# EAGLE design PCB-TOP_FINAL (EAGLE 7.6.0)
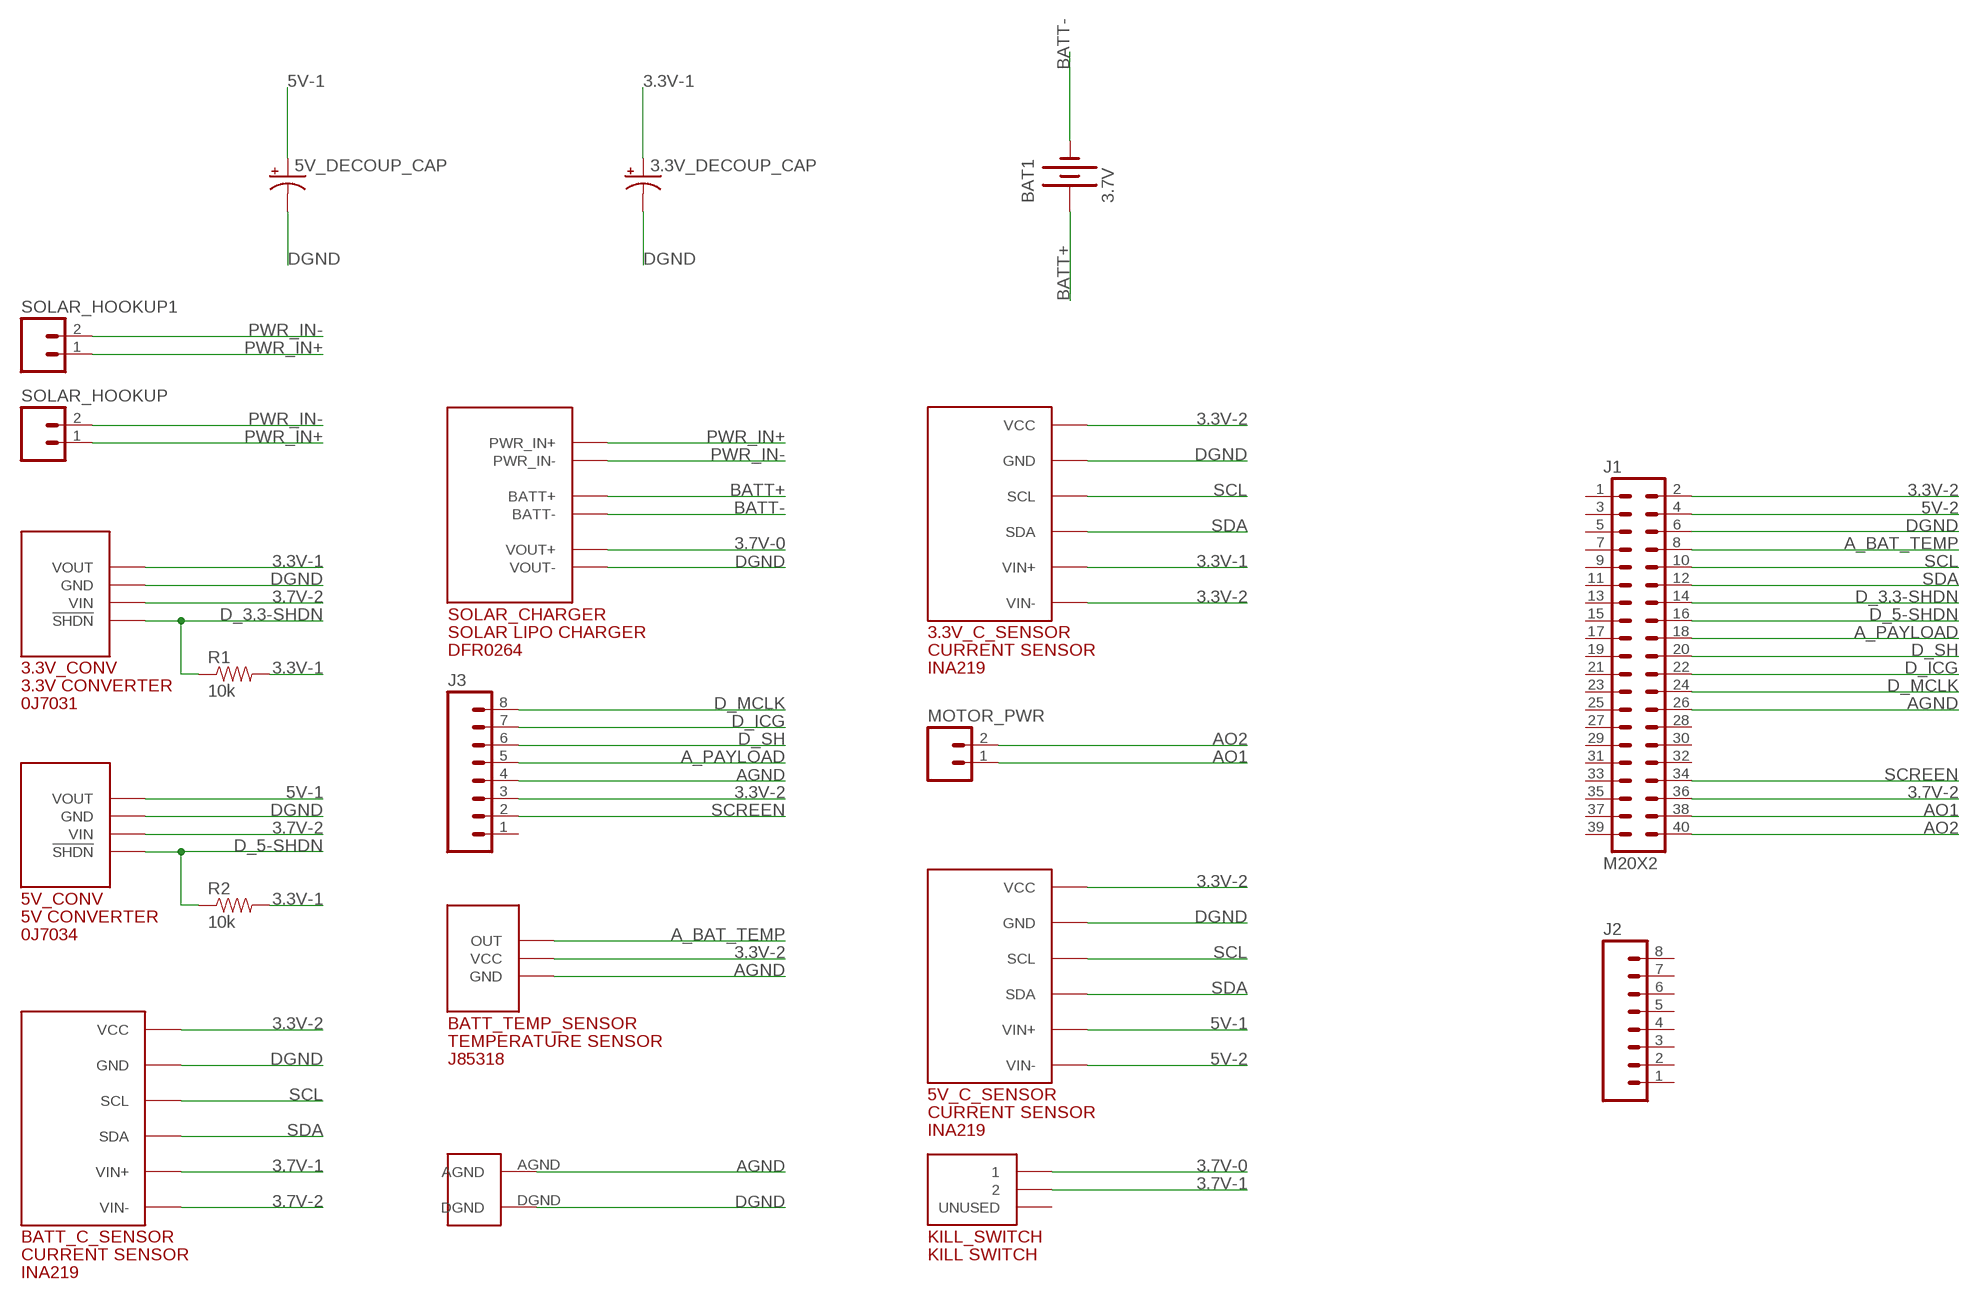
[diagram p0: schematic, sheet 1]

## Parts
3.3V_C_SENSOR  ADAFRUIT_INA219_DEVICE  [C1_ADAFRUIT_INA219_CURPOWERMONITOR]
3.3V_CONV  3V3CONVERTERDIP4  [DIP4]
3.3V_DECOUP_CAP  CAP_POLPTH1  [CPOL-RADIAL-100UF-25V]
5V_C_SENSOR  ADAFRUIT_INA219_DEVICE  [C1_ADAFRUIT_INA219_CURPOWERMONITOR]
5V_CONV  DIP14DIP4  [DIP4]
5V_DECOUP_CAP  CAP_POLPTH1  [CPOL-RADIAL-100UF-25V]
BAT1  3.7V  BATTERY18650  [BATTERY_18650-HOLDER]
BATT_C_SENSOR  ADAFRUIT_INA219_DEVICE  [C1_ADAFRUIT_INA219_CURPOWERMONITOR]
BATT_TEMP_SENSOR  TEMP_SENSORDIP3  [DIP3]
J1  M20X2  [2X20]
J2  M08  [1X08_ROUND]
J3  M08  [1X08_ROUND]
KILL_SWITCH  KILLSWITCH_V2_DEVICE  [KILLSWITCH_V2_PACKAGE]
MOTOR_PWR  M02PTH  [1X02]
R1  10k  10KOHM-1/4W-1%(PTH)HORIZ  [AXIAL-0.3]
R2  10k  10KOHM-1/4W-1%(PTH)HORIZ  [AXIAL-0.3]
SOLAR_CHARGER  SOLAR_CHARGER_DEVICE  [SOLAR_CHARGER_PACKAGE]
SOLAR_HOOKUP  M02PTH  [1X02]
SOLAR_HOOKUP1  M02PTH  [1X02]
U$1  GROUNDPLANECONNECTION_BOTTOM  [GROUNDPLANECONNECTION_BOTTOM]

## Nets
3.3V-1: 3.3V_C_SENSOR.VIN+ 3.3V_CONV.VOUT 3.3V_DECOUP_CAP.1(+) R1.P$2 R2.P$2
3.3V-2: 3.3V_C_SENSOR.VCC 3.3V_C_SENSOR.VIN- 5V_C_SENSOR.VCC BATT_C_SENSOR.VCC BATT_TEMP_SENSOR.VCC J1.2 J3.3
3.7V-0: KILL_SWITCH.1 SOLAR_CHARGER.VOUT+
3.7V-1: BATT_C_SENSOR.VIN+ KILL_SWITCH.2
3.7V-2: 3.3V_CONV.VIN 5V_CONV.VIN BATT_C_SENSOR.VIN- J1.36
5V-1: 5V_C_SENSOR.VIN+ 5V_CONV.VOUT 5V_DECOUP_CAP.1(+)
5V-2: 5V_C_SENSOR.VIN- J1.4
A_BAT_TEMP: BATT_TEMP_SENSOR.OUT J1.8
A_PAYLOAD: J1.18 J3.5
AGND: BATT_TEMP_SENSOR.GND J1.26 J3.4 U$1.AGND
AO1: J1.38 MOTOR_PWR.1
AO2: J1.40 MOTOR_PWR.2
BATT+: BAT1.PWR@1(+) SOLAR_CHARGER.BATT+
BATT-: BAT1.GND@1(-) SOLAR_CHARGER.BATT-
D_3.3-SHDN: 3.3V_CONV.SHDN(!SHDN!) J1.14 R1.P$1
D_5-SHDN: 5V_CONV.SHDN(!SHDN!) J1.16 R2.P$1
D_ICG: J1.22 J3.7
D_MCLK: J1.24 J3.8
D_SH: J1.20 J3.6
DGND: 3.3V_C_SENSOR.GND 3.3V_CONV.GND 3.3V_DECOUP_CAP.2(-) 5V_C_SENSOR.GND 5V_CONV.GND 5V_DECOUP_CAP.2(-) BATT_C_SENSOR.GND J1.6 SOLAR_CHARGER.VOUT- U$1.DGND
PWR_IN+: SOLAR_CHARGER.PWR_IN+ SOLAR_HOOKUP1.1 SOLAR_HOOKUP.1
PWR_IN-: SOLAR_CHARGER.PWR_IN- SOLAR_HOOKUP1.2 SOLAR_HOOKUP.2
SCL: 3.3V_C_SENSOR.SCL 5V_C_SENSOR.SCL BATT_C_SENSOR.SCL J1.10
SCREEN: J1.34 J3.2
SDA: 3.3V_C_SENSOR.SDA 5V_C_SENSOR.SDA BATT_C_SENSOR.SDA J1.12
Unconnected: J1.1 J1.3 J1.5 J1.7 J1.9 J1.11 J1.13 J1.15 J1.17 J1.19 J1.21 J1.23 J1.25 J1.27 J1.28 J1.29 J1.30 J1.31 J1.32 J1.33 J1.35 J1.37 J1.39 J2.1 J2.2 J2.3 J2.4 J2.5 J2.6 J2.7 J2.8 J3.1 KILL_SWITCH.UNUSED

## Library data of the parts
3.3V_C_SENSOR 5V_C_SENSOR BATT_C_SENSOR = Adafruit_INA219:ADAFRUIT_INA219_DEVICE
3.3V_CONV = 3v3Converter-0J7031:3V3CONVERTER
3.3V_DECOUP_CAP 5V_DECOUP_CAP = SparkFun-Passives:CAP_POL: Capacitor Polarized These are standard SMD and PTH capacitors. Normally 10uF, 47uF, and 100uF in electrolytic and tantalum varieties. Always verify the external diameter of the through hole cap, it varies with capacity, voltage, and manufacturer. The EIA devices should be standard.
5V_CONV = 5VConverter_0J7034:DIP14
BAT1 = SparkFun-Electromechanical:BATTERY: Battery Holders Various common sizes : AA, AAA, 18650 (PRT-12895), 20mm coin cell and 12mm coin cell. 20MM_4LEGS, BATT-10373
BATT_TEMP_SENSOR = Temp_Sensor_K853518:TEMP_SENSOR
J1 = SparkFun-Connectors:M20X2: 0.1" spaced headers
J2 J3 = SparkFun-Connectors:M08: Header 8 Standard 8-pin 0.1" header. Use with straight break away headers (SKU : PRT-00116), right angle break away headers (PRT-00553), swiss pins (PRT-00743), machine pins (PRT-00117), and female headers (PRT-00115).; PROD_ID: CONN-08437
KILL_SWITCH = Kill Switch_v2:KILLSWITCH_V2_DEVICE
MOTOR_PWR SOLAR_HOOKUP SOLAR_HOOKUP1 = SparkFun-Connectors:M02: Standard 2-pin 0.1" header. Use with - straight break away headers ( PRT-00116) - right angle break away headers (PRT-00553) - swiss pins (PRT-00743) - machine pins (PRT-00117) - female headers (PRT-00115) Molex polarized connector foot print use with: PRT-08233 with associated crimp pins and housings. 2.54_SCREWTERM for use with PRT-10571. 3.5mm Screw Terminal footprints for PRT-08084 5mm Screw Terminal footprints for use with PRT-08432
R1 R2 = SparkFun-Resistors:10KOHM-1/4W-1%(PTH): RES-12183; PROD_ID: RES-12183
SOLAR_CHARGER = Solar Charger:SOLAR_CHARGER_DEVICE
U$1 = BOTTOM_Groundplaneconnection:GROUNDPLANECONNECTION_BOTTOM

## Board
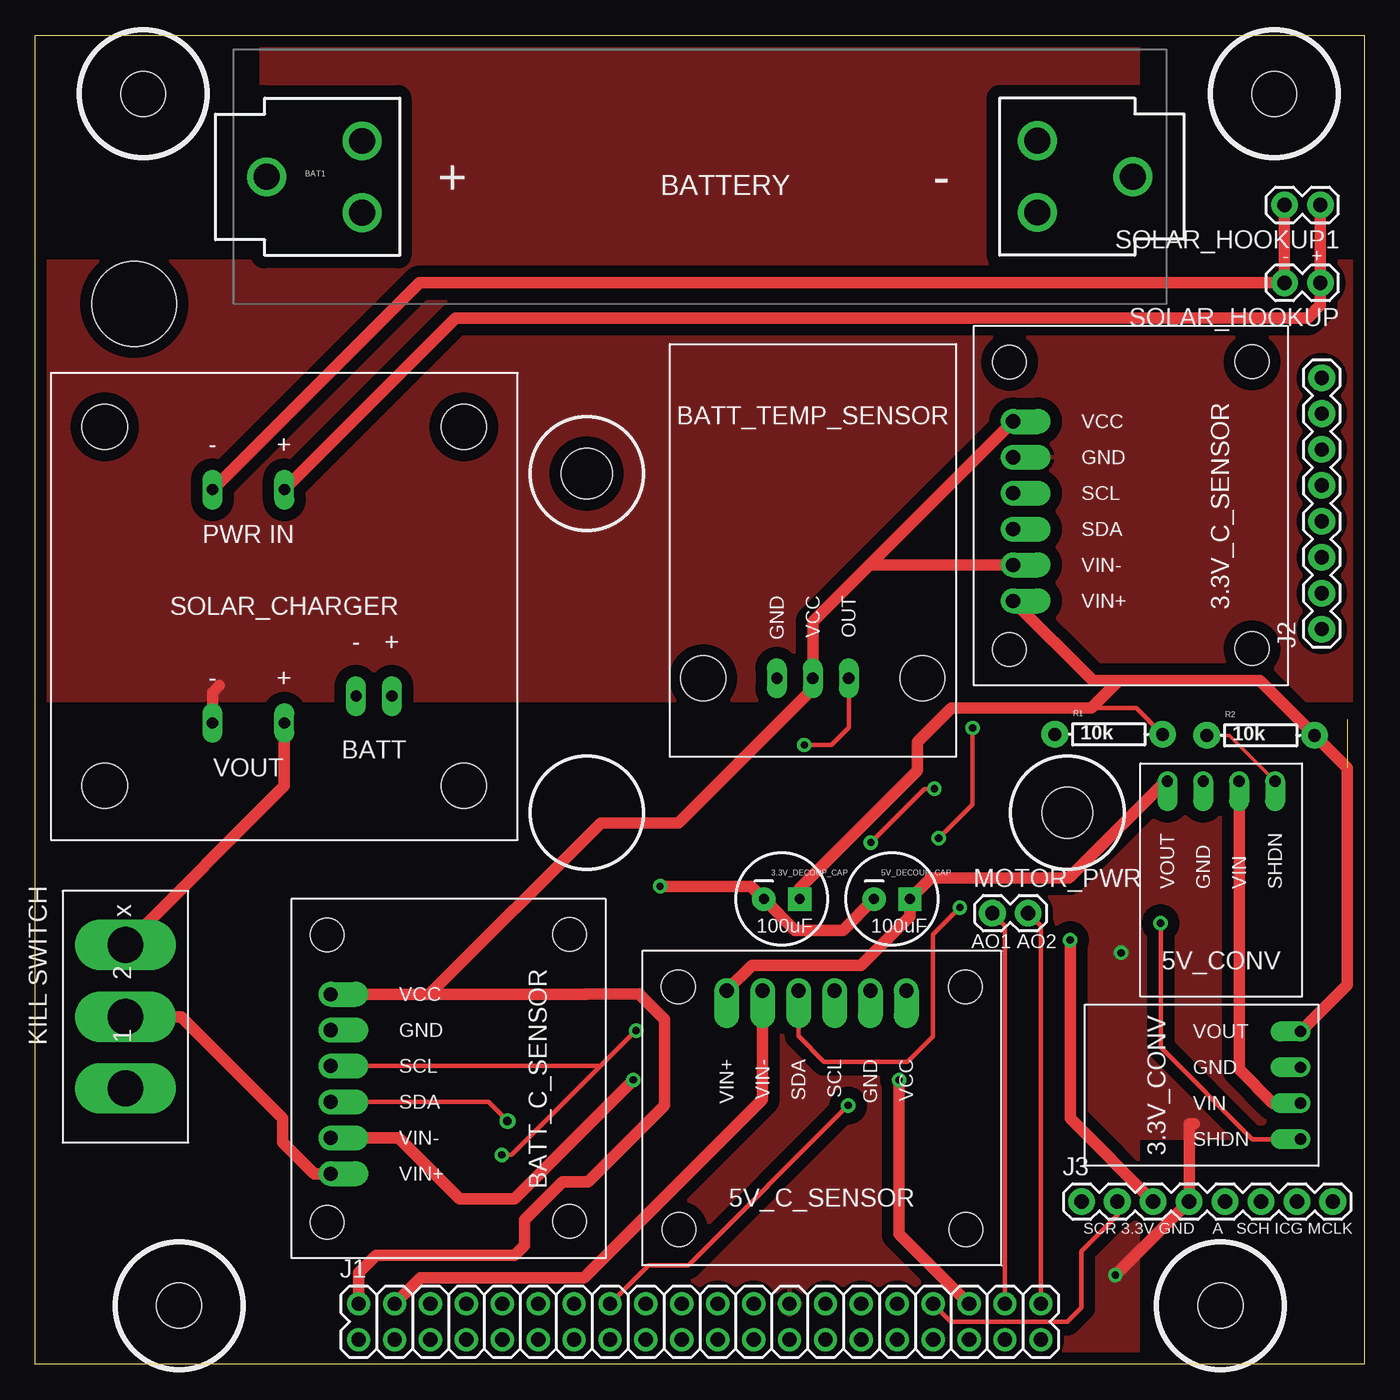
[diagram p1: board, top side]
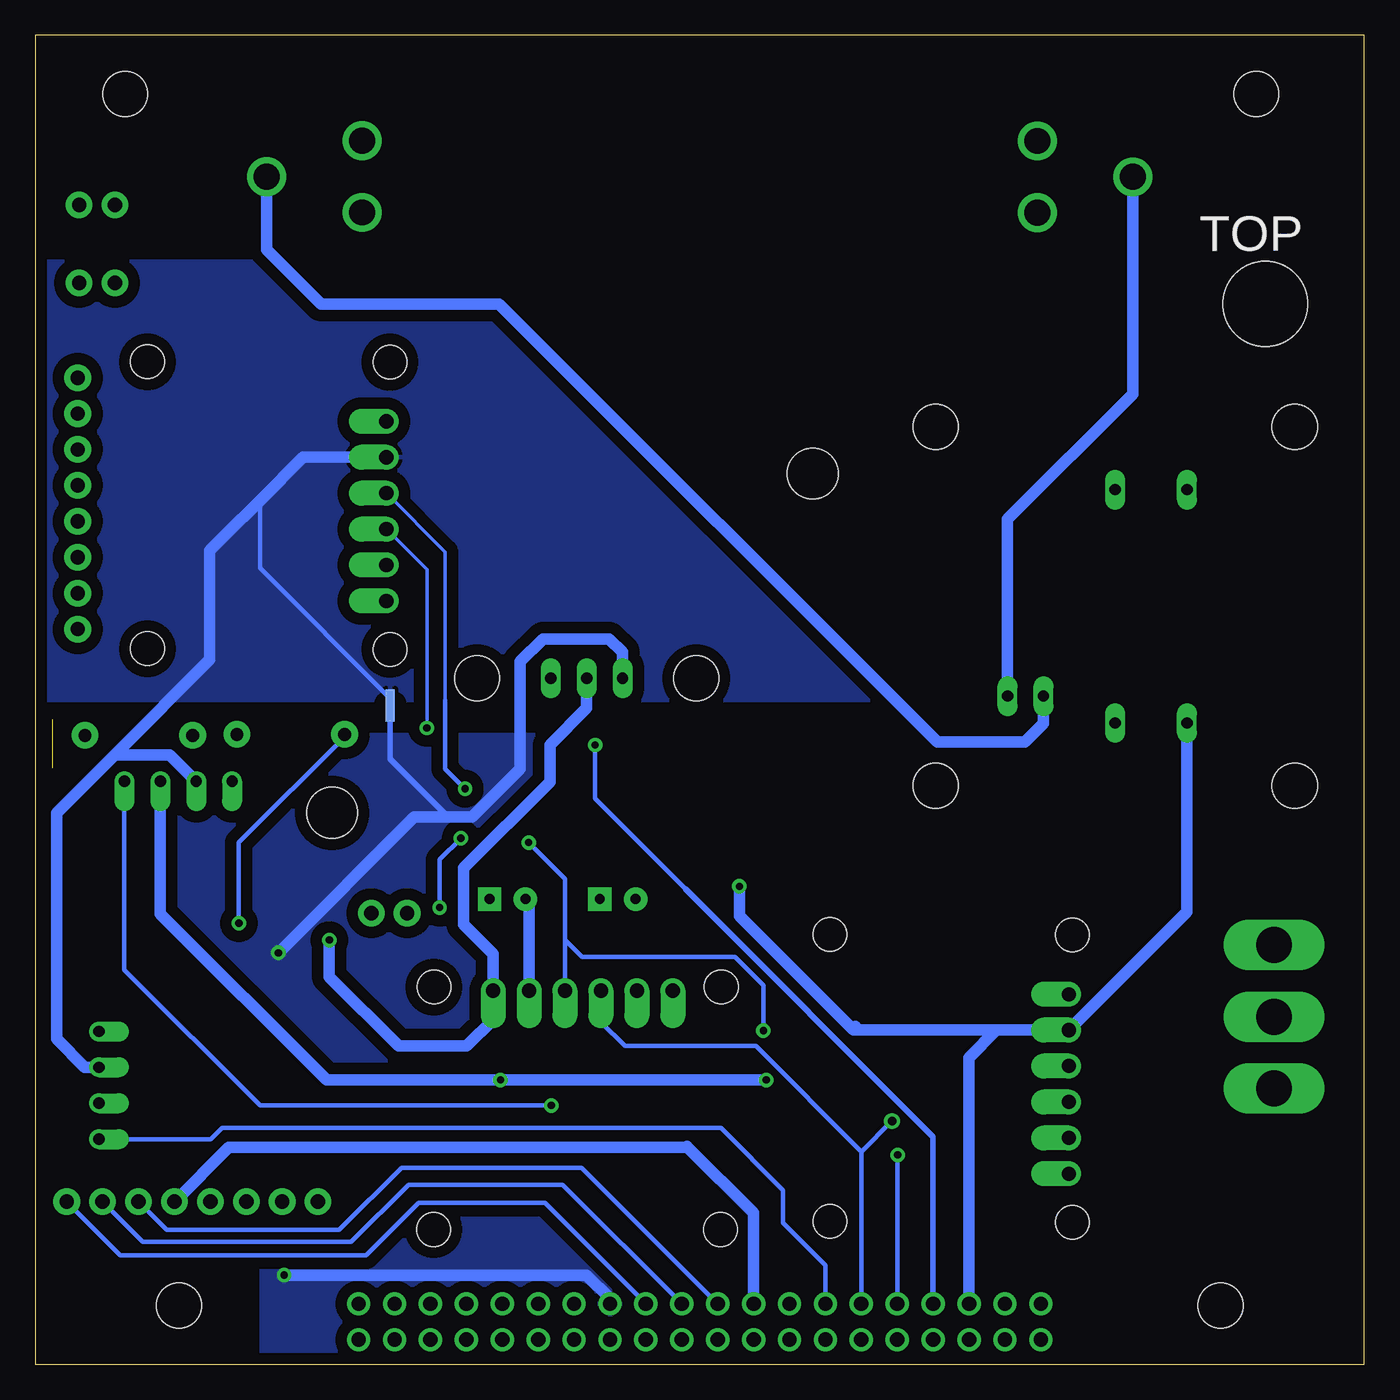
[diagram p2: board, bottom side, seen from below]

Size 94 x 94 mm. Coordinates in mm from the lower left corner, seen from the top.
Outline: 0,0 0,94 94,94 94,0 0,0
Copper layers (1*16): Top 0.035mm / dielectric 1.5mm / Bottom 0.035mm
Design rules "SparkFun": minimum track width 8mil, minimum drill 20mil, track to track 8mil, track to pad 8mil, pad to pad 8mil, via to via 8mil, smd to smd 8mil, copper to edge 8mil, drill to drill 8mil, minimum pad ring 12mil, minimum via ring 10mil, stop-mask expansion 4mil, vias tented up to drill 20mil, thermal gap 10mil
Holes 3.6 mm at 39,63 73,39
Holes 3.18 mm at 7.63,89.86 87.64,89.86 83.83,4.13 10.17,4.13
Holes 6 mm at 7,75

### Footprints (pad centres in the part's own frame; a part is rotated, then mirrored left to right if it is on the bottom)
C1_ADAFRUIT_INA219_CURPOWERMONITOR = drill 1 pad 1.778 offset: GND 9.271,2.794; SCL 11.811,2.794; SDA 14.351,2.794; VCC 6.731,2.794; VIN+ 19.431,2.794; VIN- 16.891,2.794 | hole 2.381: 2.54,2.54; 22.86,2.54; 2.515,19.698; 22.809,19.698
DIP4 = drill 0.8 offset: GND 0,-2.54; SHDN 0,-7.62; VIN 0,-5.08; VOUT 0,0
CPOL-RADIAL-100UF-25V = drill 0.7 pad 1.651 square: 1 1.27,0 | drill 0.7 pad 1.651: 2 -1.27,0
BATTERY_18650-HOLDER = drill 1.829: GND@1 30.628,0.01; GND@2 23.88,2.55; GND@3 23.88,-2.53; PWR@1 -30.628,-0.01; PWR@2 -23.88,2.53; PWR@3 -23.88,-2.55
DIP3 = drill 0.8 long: GND -3.02,-2.54; OUT -3.02,2.54; VCC -3.02,0 | hole 3.175: -3.02,7.75; -3.02,-7.75
2X20 = drill 1.016 pad 1.651: 1 -24.13,-1.27; 2 -24.13,1.27; 3 -21.59,-1.27; 4 -21.59,1.27; 5 -19.05,-1.27; 6 -19.05,1.27; 7 -16.51,-1.27; 8 -16.51,1.27; 9 -13.97,-1.27; 10 -13.97,1.27; 11 -11.43,-1.27; 12 -11.43,1.27; 13 -8.89,-1.27; 14 -8.89,1.27; 15 -6.35,-1.27; 16 -6.35,1.27; 17 -3.81,-1.27; 18 -3.81,1.27; 19 -1.27,-1.27; 20 -1.27,1.27; 21 1.27,-1.27; 22 1.27,1.27; 23 3.81,-1.27; 24 3.81,1.27; 25 6.35,-1.27; 26 6.35,1.27; 27 8.89,-1.27; 28 8.89,1.27; 29 11.43,-1.27; 30 11.43,1.27; 31 13.97,-1.27; 32 13.97,1.27; 33 16.51,-1.27; 34 16.51,1.27; 35 19.05,-1.27; 36 19.05,1.27; 37 21.59,-1.27; 38 21.59,1.27; 39 24.13,-1.27; 40 24.13,1.27
1X08_ROUND = drill 1.016 pad 1.88: 1 0,0; 2 2.54,0; 3 5.08,0; 4 7.62,0; 5 10.16,0; 6 12.7,0; 7 15.24,0; 8 17.78,0
KILLSWITCH_V2_PACKAGE = drill 2.54 pad 3.048 long: 1 2.54,3.175; 2 7.62,3.175; UNUSED 12.7,3.175
1X02 = drill 1.016 pad 1.88: 1 0,0; 2 2.54,0
AXIAL-0.3 = drill 0.9 pad 1.88: P$1 -3.81,0; P$2 3.81,0
SOLAR_CHARGER_PACKAGE = drill 0.8 long: BATT+ 24.13,10.16; BATT- 21.59,10.16; PWR_IN+ 16.51,24.765; PWR_IN- 11.43,24.765; VOUT+ 16.51,8.255; VOUT- 11.43,8.255 | hole 3.2: 3.81,3.81; 29.21,3.81; 29.21,29.21; 3.81,29.21
GROUNDPLANECONNECTION_BOTTOM = smd 1.27 x 0.635 bottom: AGND -1,0; DGND 0,0

### Placement (x,y rotation side)
3.3V_C_SENSOR  66.37,73.42 270 top
3.3V_CONV  89.5,23.54 0 top
3.3V_DECOUP_CAP  52.8,32.9 0 top
5V_C_SENSOR  68.34,29.22 180 top
5V_CONV  80.08,41.23 90 top
5V_DECOUP_CAP  60.6,32.9 0 top
BAT1  47,84 0 top
BATT_C_SENSOR  18.1,32.9 270 top
BATT_TEMP_SENSOR  55,45.5 270 top
J1  47,3 0 top
J2  91,52 90 top
J3  74,11.5 0 top
KILL_SWITCH  3.2,32.2 270 top
MOTOR_PWR  67.7,31.9 0 top
R1  75.93,44.55 0 top
R2  86.68,44.48 0 top
SOLAR_CHARGER  1.1,37.1 0 top
SOLAR_HOOKUP  90.9,76.5 180 top
SOLAR_HOOKUP1  90.9,82 180 top
U$1  68.9,47.1 90 top

### Tracks (layer width: path | path; a pad name or v marks a point on that pad's centre or on a via)
3.3V-1  (1 unrouted)
  Top 0.305: 74.7,46.4 77.89,46.4 R1.P$2
  Top 0.813: 3.3V_DECOUP_CAP.1 54.07,33.67 62.4,42 62.4,44 64.8,46.4 74.7,46.4 76.65,48.35 | 3.3V_CONV.VOUT 92.8,26.84 92.8,42.17 R2.P$2 86.62,48.35 76.65,48.35 | 3.3V_C_SENSOR.VIN+ 74.8,48.35 76.65,48.35
3.3V-2  (via drill 0.51)
  Top 0.813: BATT_C_SENSOR.VCC 27.87,26.17 | 27.87,26.17 38.97,26.17 39,26.2 42.7,26.2 44.5,24.4 44.5,18.3 39.1,12.9 37.3,12.9 34.6,10.2 34.6,8.4 33.9,7.7 24.1,7.7 22.87,6.47 J1.2 | v73.2,30 73.2,17.38 J3.3 | 27.87,26.17 40,38.3 45.5,38.3 55,47.8 BATT_TEMP_SENSOR.VCC 55,52.52 59,56.53 | 59,56.53 3.3V_C_SENSOR.VCC | 3.3V_C_SENSOR.VIN- 59,56.53
  Bottom 0.813: BATT_TEMP_SENSOR.VCC 55,46.4 57.6,43.8 57.6,41.2 63.7,35.1 63.7,31.1 61.61,29.01 5V_C_SENSOR.VCC 61.6,26.42 61.6,24.4 63.5,22.5 68.3,22.5 73.2,27.4 v73.2,30
3.7V-0
  Top 0.813: KILL_SWITCH.1 17.61,40.9 SOLAR_CHARGER.VOUT+
3.7V-1
  Top 0.813: KILL_SWITCH.2 10.32,24.58 17.5,17.4 17.5,15.7 19.73,13.47 BATT_C_SENSOR.VIN+
3.7V-2  (via drill 0.51)
  Top 0.813: v42.3,20.1 33.9,11.7 30,11.7 25.69,16.01 BATT_C_SENSOR.VIN- | 85.16,39.54 5V_CONV.VIN 85.16,20.84 87.54,18.46 3.3V_CONV.VIN | J1.36 61.1,9.22 v61.1,20.1
  Bottom 0.813: v42.3,20.1 v61.1,20.1 73.4,20.1 85.16,31.86 5V_CONV.VIN
5V-1
  Top 0.813: 5V_CONV.VOUT 79.93,41.23 73.1,34.4 63.37,34.4 5V_DECOUP_CAP.1 61.87,31.67 58.4,28.2 50.68,28.2 5V_C_SENSOR.VIN+
5V-2
  Top 0.813: J1.4 27.24,6.1 38.8,6.1 51.45,18.75 5V_C_SENSOR.VIN-
A_BAT_TEMP  (via drill 0.51)
  Top 0.305: v54.4,43.8 56.3,43.8 57.54,45.04 BATT_TEMP_SENSOR.OUT
  Bottom 0.305: 48,33.6 54.4,40 v54.4,43.8
  Bottom 0.406: 48,33.6 30.49,16.09 J1.8
A_PAYLOAD
  Bottom 0.813: J1.18 43.19,10.69 47.85,15.35 | 47.85,15.35 47.9,15.4 | 47.85,15.35 80.31,15.35 J3.5
AGND  (via drill 0.51)
  Top 0.813: 82,17 81.62,17 J3.4 81.6,11.5 v76.4,6.3
  Bottom 0.406: U$1.AGND 68.9,42.8 64.8,38.7
  Bottom 0.813: J1.26 53.35,4.65 55,6.3 v76.4,6.3 | BATT_TEMP_SENSOR.GND 52.46,50.36 53.4,51.3 58.1,51.3 59.7,49.7 59.7,42.1 63.1,38.7 64.8,38.7 67.2,38.7 v76.8,29.1
  pour Bottom (isolate 0.813): 94,44.5 0,44.5 0,16 16,16 16,0 78,0 78,16 94,16
  pour Top (isolate 0.813): 0,16 16,16 16,0 78,0 78,16 94,16 94,44.5 0,44.5
AO1
  Top 0.305: J1.38 68.59,31.01 MOTOR_PWR.1
AO2
  Top 0.305: J1.40 71.13,31.01 MOTOR_PWR.2
BATT+
  Bottom 0.813: BAT1.PWR@1 16.37,68.63 25.23,59.77 SOLAR_CHARGER.BATT+
BATT-
  Bottom 0.813: BAT1.GND@1 77.63,78.83 73.8,75 61.2,75 30.2,44 24,44 22.69,45.31 SOLAR_CHARGER.BATT-
D_3.3-SHDN  (via drill 0.51)
  Top 0.305: v79.6,31.2 79.6,22.4 86.08,15.92 3.3V_CONV.SHDN
  Bottom 0.305: R1.P$1 72.12,44.38 79.6,36.9 v79.6,31.2 | J1.14 38.1,7 41.1,10 41.1,12.3 45.5,16.7 80.8,16.7 81.58,15.92 3.3V_CONV.SHDN
D_5-SHDN  (via drill 0.51)
  Top 0.254: 5V_CONV.SHDN 84.45,44.48 R2.P$1
  Top 0.305: v57.5,18.3 46.2,7 43.38,7 J1.16
  Bottom 0.305: v57.5,18.3 78.1,18.3 87.7,27.9 5V_CONV.SHDN
D_ICG
  Bottom 0.305: J1.22 56.7,12.7 67.6,12.7 71.65,8.65 86.39,8.65 J3.7
D_MCLK
  Bottom 0.305: J1.24 57.94,11.4 66.9,11.4 70.6,7.7 87.98,7.7 J3.8
D_SH
  Bottom 0.305: J1.20 55.36,13.9 68.1,13.9 72.5,9.5 84.7,9.5 J3.6
DGND  (via drill 0.51)
  Top 0.813: v44.2,33.8 50.63,33.8 3.3V_DECOUP_CAP.2 53.73,30.7 57.13,30.7 5V_DECOUP_CAP.2 | SOLAR_CHARGER.VOUT- 12.53,47.53 13,48
  Bottom 0.305: 80.4,58.6 80.6,58.6 | U$1.DGND 78.1,56.3 78.1,61.1
  Bottom 0.813: 26,23.63 BATT_C_SENSOR.GND 12.53,31.99 SOLAR_CHARGER.VOUT- | 26,23.63 36,23.63 | 36,23.63 36.13,23.63 44.2,31.7 v44.2,33.8 | 5V_C_SENSOR.GND 59.07,32.64 5V_DECOUP_CAP.2 | 3.3V_C_SENSOR.GND 75.05,64.15 78.1,61.1 80.6,58.6 81.65,57.55 81.65,49.85 88.25,43.25 | J1.6 27.95,21.68 26,23.63 | 36,23.89 36,23.63 | 5V_CONV.GND 84.49,43.1 88.1,43.1 88.25,43.25 | 88.25,43.25 92.5,39 92.5,23 90.5,21 3.3V_CONV.GND
  pour Bottom (isolate 0.813): 0,78 16,78 16,94 78,94 78,78 94,78 94,47 0,47
  pour Top (isolate 0.813): 0,78 16,78 16,94 78,94 78,78 94,78 94,47 0,47
PWR_IN+
  Top 0.813: SOLAR_CHARGER.PWR_IN+ 29.75,74 90,74 90.9,74.9 SOLAR_HOOKUP.1 SOLAR_HOOKUP1.1
PWR_IN-
  Top 0.813: SOLAR_CHARGER.PWR_IN- 27.16,76.5 SOLAR_HOOKUP.2 SOLAR_HOOKUP1.2
SCL  (via drill 0.51)
  Top 0.305: 39.99,21.09 v42.5,23.6 | v63.6,40.7 62.9,40.7 v59.1,36.9 | BATT_C_SENSOR.SCL 39.99,21.09 | 39.99,21.09 33.7,14.8 v33,14.8
  Bottom 0.254: 3.3V_C_SENSOR.SCL 65,57.45 65,47
  Bottom 0.305: J1.10 33.03,14.77 v33,14.8 | v42.5,23.6 42.5,26.8 44.5,28.8 55.33,28.8 56.53,30 | 5V_C_SENSOR.SCL 56.53,30 | 56.53,30 56.53,34.33 v59.1,36.9 | 65,47 65,42.1 v63.6,40.7
SCREEN
  Top 0.305: J1.34 64.78,3 73,3 74,4 74,8 76.54,10.54 J3.2
SDA  (via drill 0.51, 0.6)
  Top 0.305: v66.3,45 66.3,39.6 v63.9,37.2 | v65.4,32.3 63.5,30.4 63.5,23.2 61.7,21.4 55.8,21.4 53.99,23.21 5V_C_SENSOR.SDA | v33.4,17.2 32.05,18.55 BATT_C_SENSOR.SDA
  Bottom 0.254: 3.3V_C_SENSOR.SDA 66.3,56.2 v66.3,45
  Bottom 0.305: J1.12 35.57,15.03 | 35.57,15.03 43.04,22.5 52.3,22.5 53.99,24.19 5V_C_SENSOR.SDA | v65.4,32.3 65.4,35.7 v63.9,37.2 | 35.57,15.03 v33.4,17.2

### Text on the board
tPlace: BATTERY | - + | 100uF | 100uF | AO1 AO2 | SCR 3.3V GND A SCH ICG MCLK
bPlace: TOP